# EasyEDA schematic SCH_Lab-bench-Power-Supply_2025-04-24.json
TITLE: Lab-bench-Power-Supply; REV: 5.1; Date: 2025-04-24; Sheet: 1/1; Drawn By: HCCFish; Company: HCCLAB
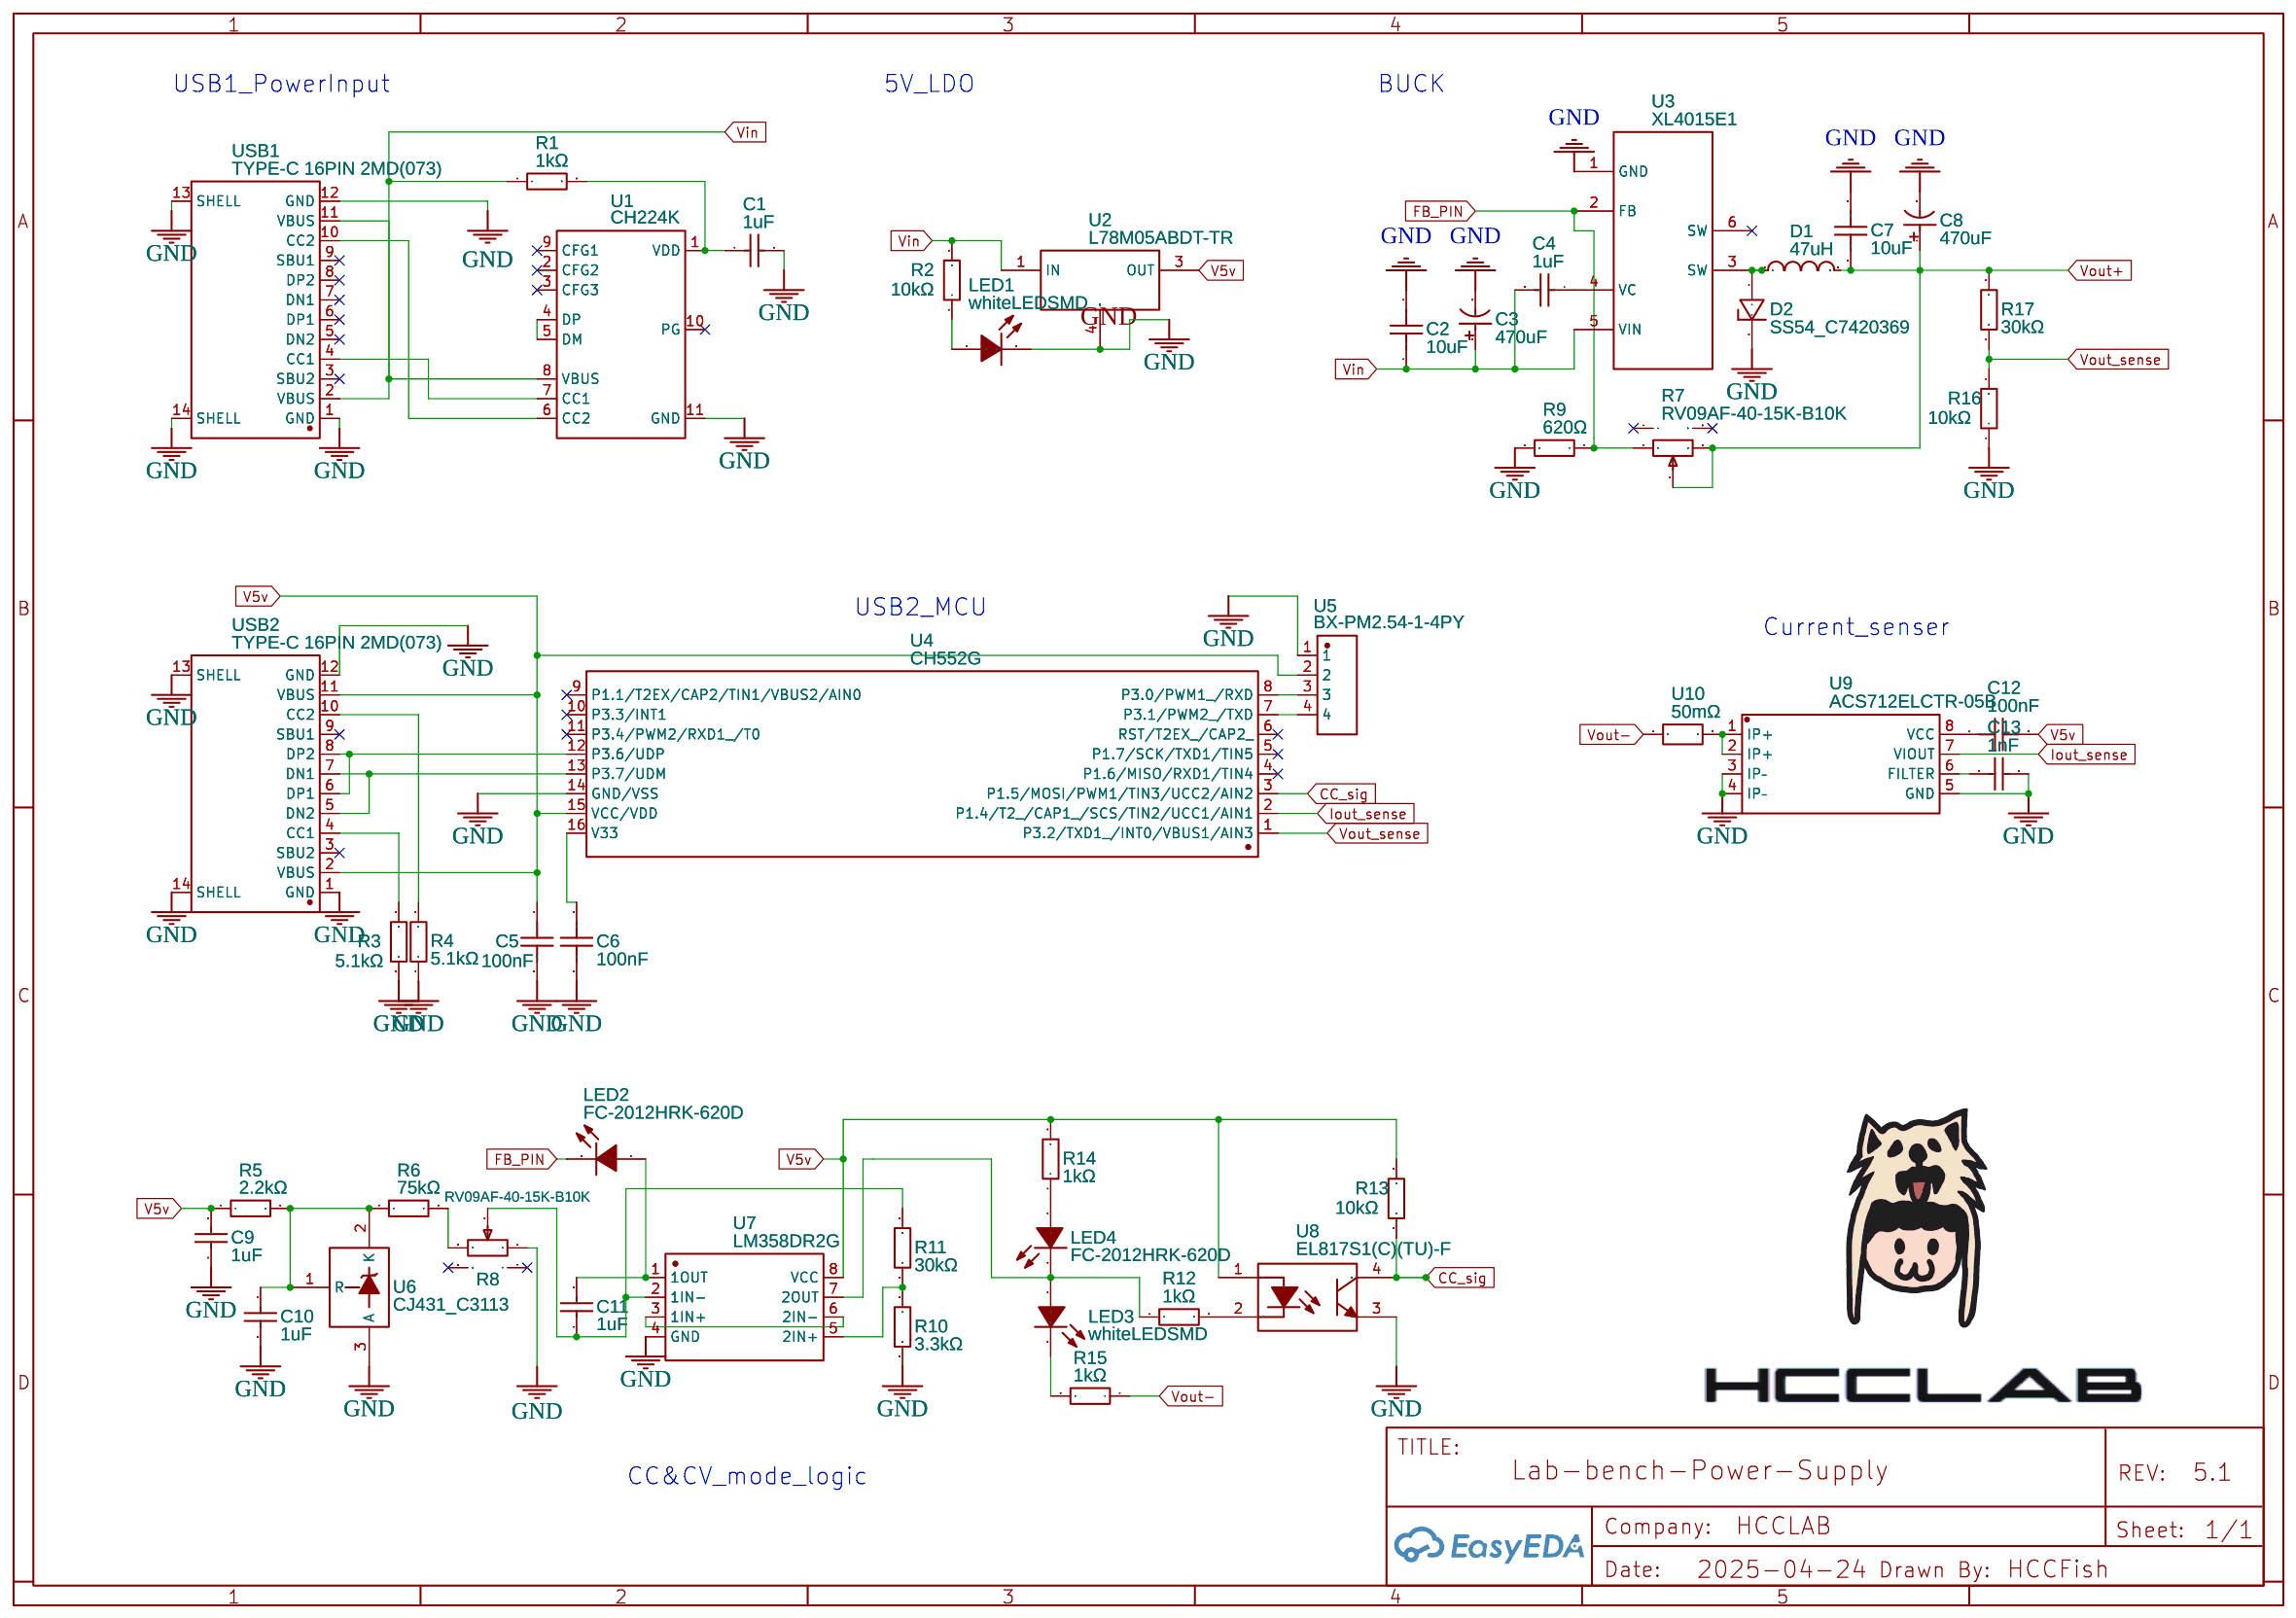
[diagram p0: schematic sheet]

## Parts
C1  1uF  [C0805]
C2  10uF  [C0805]
C3  470uF  [CAP-TH_BD8.0-P3.50-D0.6-FD]
C4  1uF  [C0805]
C5  100nF  [C0805]
C6  100nF  [C0805]
C7  10uF  [C0805]
C8  470uF  [CAP-TH_BD8.0-P3.50-D0.6-FD]
C9  1uF  [C0805]
C10  1uF  [C0805]
C11  1uF  [C0805]
C12  100nF  [C0805]
C13  1nF  [C0805]
D1  47uH  [IND-SMD_L12.6-W12.5-SRP1265A-220M]
D2  SS54_C7420369  [SMA_L4.3-W2.6-LS5.0-FD]
LED1  whiteLEDSMD  [LED0805-R-RD]
LED2  FC-2012HRK-620D  [LED0805-R-RD]
LED3  whiteLEDSMD  [LED0805-R-RD]
LED4  FC-2012HRK-620D  [LED0805-R-RD]
R1  1kΩ  [R0805]
R2  10kΩ  [R0805]
R3  5.1kΩ  [R0805]
R4  5.1kΩ  [R0805]
R5  2.2kΩ  [R0805]
R6  75kΩ  [R0805]
R7  RV09AF-40-15K-B10K  [RES-ADJ-TH_RV09]
R8  RV09AF-40-15K-B10K  [RES-ADJ-TH_RV09]
R9  620Ω  [R0603]
R10  3.3kΩ  [R0805]
R11  30kΩ  [R0805]
R12  1kΩ  [R0805]
R13  10kΩ  [R0805]
R14  1kΩ  [R0805]
R15  1kΩ  [R0805]
R16  10kΩ  [R0805]
R17  30kΩ  [R0805]
U1  CH224K  [ESSOP-10_L4.9-W3.9-P1.0-LS6.0-TL-EP]
U2  L78M05ABDT-TR  [TO-252-2_L6.5-W6.1-P4.58-LS10.0-TL]
U3  XL4015E1  [TO-263-5_L10.2-W8.9-P1.70-TL]
U4  CH552G  [SOP-16_L10.0-W3.9-P1.27-LS6.0-BL]
U5  BX-PM2.54-1-4PY  [HDR-TH_4P-P2.54-V-F]
U6  CJ431_C3113  [SOT-23-3_L2.9-W1.6-P1.90-LS2.8-BR]
U7  LM358DR2G  [SOIC-8_L5.0-W4.0-P1.27-LS6.0-BL]
U8  EL817S1(C)(TU)-F  [OPTO-SMD-4_L4.6-W6.5-P2.54-LS10.3-TL]
U9  ACS712ELCTR-05B  [SOP-8_L4.9-W3.9-P1.27-LS6.0-BL]
U10  50mΩ  [R2512]
USB1  TYPE-C 16PIN 2MD(073)  [USB-C-SMD_TYPE-C-6PIN-2MD-073]
USB2  TYPE-C 16PIN 2MD(073)  [USB-C-SMD_TYPE-C-6PIN-2MD-073]

## Library data of the parts
C1 C4 C9-C11 = CL21B105KBFNNNE: Supplier: LCSC; Manufacturer: SAMSUNG(三星); Supplier Part: C28323; JLCPCB Part Class: Basic Part
C2 C7 = CL21A106KAYNNNE: Supplier: LCSC; Manufacturer: SAMSUNG(三星); Supplier Part: C15850; JLCPCB Part Class: Basic Part
C3 C8 = 470uF 25V 8*12: Supplier: LCSC; Manufacturer: CX(承兴); Manufacturer Part: KM477M025F12RR0VH2FP0; Supplier Part: C43839; JLCPCB Part Class: Extended Part
C5 C6 C12 = CC0805KRX7R9BB104: Supplier: LCSC; Manufacturer: YAGEO(国巨); Supplier Part: C49678; JLCPCB Part Class: Basic Part
C13 = CL21B102KBCNNNC: Supplier: LCSC; Manufacturer: SAMSUNG(三星); Supplier Part: C46653; JLCPCB Part Class: Basic Part
D1 = SRP1265A-470M: Contributor: LCSC; Supplier: LCSC; Supplier Part: C840530; Manufacturer: BOURNS; JLCPCB Part Class: Extended Part
D2 = SS54_C7420369: Supplier: LCSC; Supplier Part: C7420369; Manufacturer: 宏迦橙; Manufacturer Part: SS54; Contributor: lcsc; JLCPCB Part Class: Extended Part
LED1 LED3 = whiteLEDSMD: Supplier: LCSC; Manufacturer: KENTO; Manufacturer Part: KT-0805W; Supplier Part: C34499; JLCPCB Part Class: Basic Part
LED2 LED4 = FC-2012HRK-620D: Supplier: LCSC; Manufacturer: 国星光电; Manufacturer Part: NCD0805R1; Supplier Part: C84256; JLCPCB Part Class: Basic Part
R1 R12 R14 R15 = 0805W8F1001T5E: Supplier: LCSC; Manufacturer: UNI-ROYAL(厚声); Supplier Part: C17513; JLCPCB Part Class: Basic Part
R2 R13 R16 = 0805W8F1002T5E: Supplier: LCSC; Manufacturer: UNI-ROYAL(厚声); Supplier Part: C17414; JLCPCB Part Class: Basic Part
R3 R4 = 0805W8F5101T5E: Supplier: LCSC; Manufacturer: UNI-ROYAL(厚声); Supplier Part: C27834; JLCPCB Part Class: Basic Part
R5 = 0805W8F2201T5E: Supplier: LCSC; Manufacturer: UNI-ROYAL(厚声); Supplier Part: C17520; JLCPCB Part Class: Basic Part
R6 = 0805W8F7502T5E: Supplier: LCSC; Manufacturer: UNI-ROYAL(厚声); Supplier Part: C17819; JLCPCB Part Class: Extended Part
R7 R8 = RV09AF-40-15K-B10K: Contributor: lcsc; Supplier: LCSC; Supplier Part: C5151445; Manufacturer: null; JLCPCB Part Class: Extended Part
R9 = 0603WAF6200T5E: Supplier: LCSC; Manufacturer: UNI-ROYAL(厚声); Supplier Part: C23220; JLCPCB Part Class: Extended Part
R10 = 0805W8F3301T5E: Supplier: LCSC; Manufacturer: UNI-ROYAL(厚声); Supplier Part: C26010; JLCPCB Part Class: Basic Part
R11 R17 = 0805W8F3002T5E: Supplier: LCSC; Manufacturer: UNI-ROYAL(厚声); Supplier Part: C17621; JLCPCB Part Class: Basic Part
U1 = CH224K: Contributor: lcsc; Supplier: LCSC; Supplier Part: C970725; Manufacturer: WCH(南京沁恒); JLCPCB Part Class: Extended Part
U2 = L78M05ABDT-TR: Supplier: LCSC; Manufacturer: ST(意法半导体); Supplier Part: C58069; JLCPCB Part Class: Basic Part
U3 = XL4015E1: Supplier: LCSC; Manufacturer: XLSEMI(芯龙); Supplier Part: C51661; JLCPCB Part Class: Extended Part
U4 = CH552G: Supplier: LCSC; Manufacturer: WCH(南京沁恒); Supplier Part: C111292; JLCPCB Part Class: Extended Part
U5 = BX-PM2.54-1-4PY: Supplier: LCSC; Supplier Part: C18078127; Manufacturer: Bossie(博锡); Contributor: lcsc; JLCPCB Part Class: Extended Part
U6 = CJ431_C3113: Supplier: LCSC; Manufacturer: CJ(江苏长电/长晶); Manufacturer Part: CJ431; Supplier Part: C3113; JLCPCB Part Class: Basic Part
U7 = LM358DR2G: Supplier: LCSC; Manufacturer: onsemi(安森美); Supplier Part: C7950; JLCPCB Part Class: Basic Part
U8 = EL817S1(C)(TU)-F: Supplier: LCSC; Manufacturer: EVERLIGHT(亿光); Supplier Part: C106900; JLCPCB Part Class: Extended Part
U9 = ACS712ELCTR-05B: Contributor: LCSC; Supplier: LCSC; Supplier Part: C18390; Manufacturer: ALLEGRO(美国埃戈罗); JLCPCB Part Class: Extended Part
U10 = HOYLR2512-3W-50MR-1%: Supplier: LCSC; Supplier Part: C5375474; Manufacturer: Milliohm(毫欧); Manufacturer Part: HoYLR2512-3W-50mR-1%; JLCPCB Part Class: Extended Part; Contributor: lcsc
USB1 USB2 = TYPE-C 16PIN 2MD(073): Contributor: LCSC; Supplier: LCSC; Supplier Part: C2765186; Manufacturer: SHOU HAN(首韩); JLCPCB Part Class: Extended Part

## Nets
GND: C1.2 C2.2 C3.2 C5.2 C6.1 C7.2 C8.2 C9.2 C10.2 C13.2 D2.2(K) LED1.2(K) R3.1 R4.1 R8.1 R9.2 R10.2 R16.1 U1.11(GND) U2.4(GND) U3.1(GND) U4.14(GND/VSS) U5.1 U6.3(A) U7.4(GND) U8.3(EM) U9.3(IP–) U9.4(IP–) U9.5(GND) USB1.1(GND) USB1.12(GND) USB1.13(SHELL) USB1.14(SHELL) USB2.1(GND) USB2.12(GND) USB2.13(SHELL) USB2.14(SHELL)
V5v: C5.1 C9.1 C12.2 R5.1 R13.2 R14.2 U2.3(OUT) U4.15(VCC/VDD) U5.2 U7.8(VCC) U8.1(AN) USB2.2(VBUS) USB2.11(VBUS)
Vin: C2.1 C3.1 C4.2 R1.1 R2.2 U1.8(VBUS) U2.1(IN) U3.5(VIN) USB1.2(VBUS) USB1.11(VBUS)
CC_sig: R13.1 U4.3(P1.5/MOSI/PWM1/TIN3/UCC2/AIN2) U8.4(COL)
FB_PIN: LED2.2(-) R7.1 R9.1 U3.2(FB)
Iout_sense: U4.2(P1.4/T2_/CAP1_/SCS/TIN2/UCC1/AIN1) U9.7(VIOUT)
Vout+: C7.1 C8.1 D1.2 R7.2 R7.3 R17.2
Vout-: R15.1 U10.1
Vout_sense: R16.2 R17.1 U4.1(P3.2/TXD1_/INT0/VBUS1/AIN3)
Net-(C1-1): C1.1 R1.2 U1.1(VDD)
Net-(C4-1): C4.1 U3.4(VC)
Net-(C6-2): C6.2 U4.16(V33)
Net-(C10-1): C10.1 R5.2 R6.1 U6.1(R) U6.2(K)
Net-(C11-1): C11.1 R8.2 R11.2 U7.2(1IN-)
Net-(C11-2): C11.2 LED2.1(+) U7.1(1OUT)
Net-(C12-1): C12.1 U9.8(VCC)
Net-(C13-1): C13.1 U9.6(FILTER)
Net-(D1-1): D1.1 D2.1(A) U3.3(SW)
Net-(LED1-1): LED1.1(A) R2.1
Net-(LED3-1): LED3.1(A) LED4.2(-) R12.1 U7.7(2OUT)
Net-(LED3-2): LED3.2(K) R15.2
Net-(LED4-1): LED4.1(+) R14.1
Net-(R3-2): R3.2 USB2.4(CC1)
Net-(R4-2): R4.2 USB2.10(CC2)
Net-(R6-2): R6.2 R8.3
Net-(R10-1): R10.1 R11.1 U7.5(2IN+)
Net-(R12-2): R12.2 U8.2(CAT)
Net-(U1-4): U1.4(DP) U1.5(DM)
Net-(U1-6): U1.6(CC2) USB1.10(CC2)
Net-(U1-7): U1.7(CC1) USB1.4(CC1)
Net-(U4-7): U4.7(P3.1/PWM2_/TXD) U5.4
Net-(U4-8): U4.8(P3.0/PWM1_/RXD) U5.3
Net-(U4-12): U4.12(P3.6/UDP) USB2.6(DP1) USB2.8(DP2)
Net-(U4-13): U4.13(P3.7/UDM) USB2.5(DN2) USB2.7(DN1)
Net-(U7-3): U7.3(1IN+) U7.6(2IN-)
Net-(U9-1): U9.1(IP+) U9.2(IP+) U10.2

Not connected (* = marked no-connect by the designer): R7 4* 5*; R8 4* 5*; U1 2(CFG2)* 3(CFG3)* 9(CFG1)* 10(PG)*; U3 6(SW)*; U4 4(P1.6/MISO/RXD1/TIN4)* 5(P1.7/SCK/TXD1/TIN5)* 6(RST/T2EX_/CAP2_)* 9(P1.1/T2EX/CAP2/TIN1/VBUS2/AIN0)* 10(P3.3/INT1)* 11(P3.4/PWM2/RXD1_/T0)*; USB1 3(SBU2)* 5(DN2)* 6(DP1)* 7(DN1)* 8(DP2)* 9(SBU1)*; USB2 3(SBU2)* 9(SBU1)*

## Notes on the sheet
- USB1_PowerInput
- 5V_LDO
- BUCK
- USB2_MCU
- Current_senser
- CC&CV_mode_logic
